# Altium project Project_ontwerpen_Soldeer_bout.PrjPcb
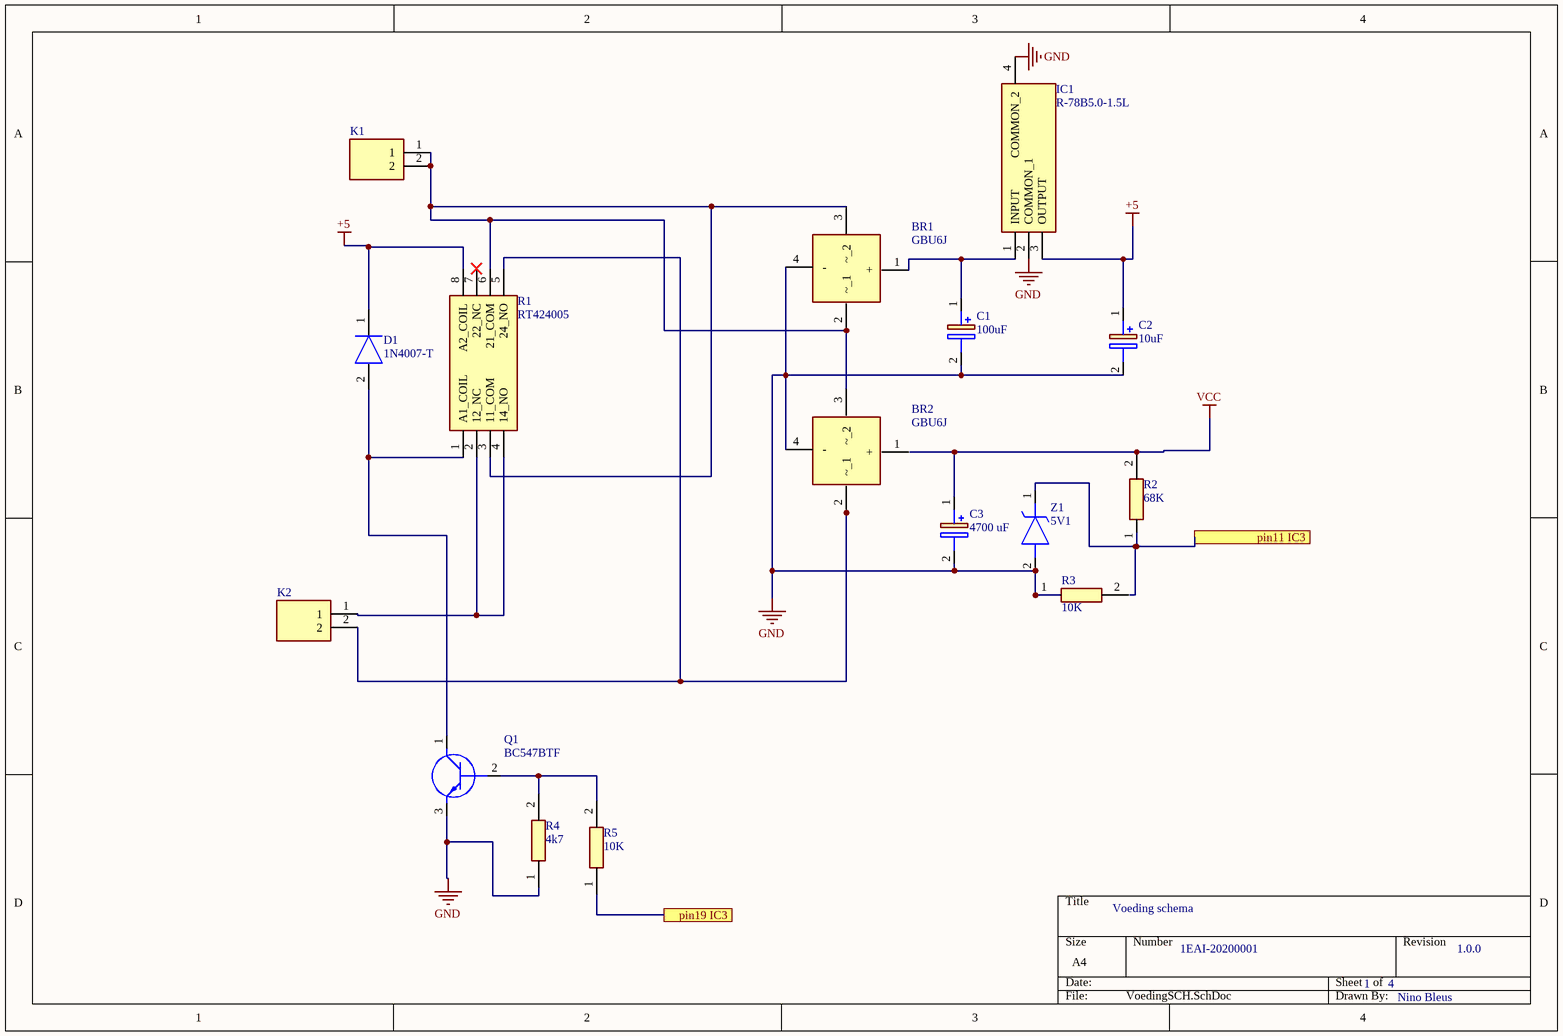
[diagram p0: VoedingSCH.SchDoc]
4 sheets, 72 parts. Net scope: flat (ports and power ports of the same name join across sheets).
Board file: PCB1.PcbDoc
Sheets:
  VoedingSCH.SchDoc
  Soldeerboute.SchDoc
  Display.SchDoc
  MainBoard.SchDoc

## Sheet VoedingSCH.SchDoc: Voeding schema
size A4; DrawnBy: Nino Bleus; Engineer: Nino Bleus; Revision: 1.0.0; SheetNumber: 1; SheetTotal: 4; number: 1EAI-20200001

### Parts
BR1  GBU6J  [GBU6J]
BR2  GBU6J  [GBU6J]
C1  100uF  [CAPPRD350W60D800H1250]
C2  10uF  [CAPPRD250W45D630H850]
C3  4700 uF  [CAPPRD1000W80D2200H3700]
D1  1N4007-T  [DIOAD1408W86L464D236]
IC1  R-78B5.0-1.5L  [TL78005CKTTR]
K1  printkroonconnector  [1729128]  (value not drawn)
K2  printkroonconnector  [1729128]  (value not drawn)
Q1  BC547BTF  [BC33740TA]
R1  RT424005  [RT42]
R2  68K  [RESC2012X65N]
R3  10K  [RESC2012X65N]
R4  4k7  [RESC2012X65N]
R5  10K  [RESC2012X65N]
Z1  5V1  [DIOAD1068W53L380D172]

### Ports
pin11 IC3, pin19 IC3

### Nets
+5: C2.1(+) D1.1(K) IC1.3(OUTPUT) R1.8(A2_COIL)
GND: BR1.4(-) BR2.4(-) C1.2(-) C2.2(-) C3.2(-) IC1.2(COMMON_1) IC1.4(COMMON_2) Q1.3(E) R3.1 R4.1 Z1.2(A)
VCC: C3.1(+) R2.2
NetBR1_1: BR1.1(+) C1.1(+) IC1.1(INPUT)
NetBR1_2: BR1.2(~_1) BR1.3(~_2) BR2.3(~_2) K1.1 K1.2 R1.3(11_COM) R1.6(21_COM)
NetBR2_2: BR2.2(~_1) K2.2 R1.5(24_NO)
NetD1_2: D1.2(A) Q1.1(C) R1.1(A1_COIL)
NetIC3_11: R2.1 Z1.1(K) ; port pin11 IC3
NetIC3_19: R5.1 ; port pin19 IC3
NetK2_1: K2.1 R1.2(12_NC) R1.4(14_NO)
NetQ1_2: Q1.2(B) R4.2 R5.2

Not connected (* = marked no-connect by the designer): BR2 1(+); R1 7(22_NC)*; R3 2

### Library data of the parts
BR1 BR2 = GBU6J: Bridge Rectifier; Manufacturer_Name: GeneSiC Semiconductor; Datasheet Link: https://www.diodemodule.com/silicon_products/bridge_rectifiers/gbu6j.pdf; Height: 18.8mm; Manufacturer_Part_Number: GBU6J
C1 = ESK107M050AG3EA: Capacitor Polarised; Manufacturer_Name: Kemet; Height: 12.5mm; Manufacturer_Part_Number: ESK107M050AG3EA
C2 = 10uF Capaciteit: Capacitor Polarised; Manufacturer_Name: Kemet; Manufacturer_Part_Number: ESS106M050AE2AA; Datasheet Link: https://content.kemet.com/datasheets/KEM_A4057_ESS.pdf; Height: 8.5mm
C3 = 4700 uF capaciteit: Capacitor Polarised; Manufacturer_Name: Kemet; Manufacturer_Part_Number: ESK478M050AQ3AA; Datasheet Link: https://componentsearchengine.com//ESK478M050AQ3AA.pdf; Height: 37mm; Mouser2 Part Number: 80-ESK478M050AQ3AA; Mouser2 Price/Stock: https://www.mouser.com/Search/Refine.aspx?Keyword=80-ESK478M050AQ3AA
D1 = 1N4007-T: Diode; Manufacturer_Name: Rectron; Datasheet Link: https://componentsearchengine.com//1N4007-T.pdf; Mouser2 Part Number: 583-1N4007-T; Mouser2 Price/Stock: https://www.mouser.com/Search/Refine.aspx?Keyword=583-1N4007-T; Manufacturer_Part_Number: 1N4007-T
IC1 = TL780-05CKTTR: Integrated Circuit; Manufacturer_Name: Texas Instruments; Datasheet Link: http://www.ti.com/general/docs/suppproductinfo.tsp?distId=26&gotoUrl=http%3A%2F%2Fwww.ti.com%2Flit%2Fgpn%2Ftl780; Height: 5.08mm; Manufacturer_Part_Number: TL780-05CKTTR
K1 K2 = printkroonconnector: Connector; Manufacturer_Name: Phoenix Contact; Datasheet Link: http://www.phoenixcontact.com/de/produkte/1729128/pdf; Height: 10.15mm; Manufacturer_Part_Number: 1729128
Q1 = BC547BTF: Transistor BJT NPN; Manufacturer_Name: ON Semiconductor; Datasheet Link: https://www.onsemi.com/pub/Collateral/BC550-D.pdf; Manufacturer_Part_Number: BC547BTF
R1 = RT424005: Relay or Contactor; Manufacturer_Name: TE Connectivity; Datasheet Link: https://componentsearchengine.com//RT424005.pdf; Mouser2 Part Number: 655-RT424005; Mouser2 Price/Stock: https://www.mouser.com/Search/Refine.aspx?Keyword=655-RT424005; Manufacturer_Part_Number: RT424005
R2-R5 = ESR10EZPJ183: Resistor; Manufacturer_Name: ROHM Semiconductor; Datasheet Link: https://datasheet.datasheetarchive.com/originals/distributors/Datasheets_SAMA/30ccb516c688c96e56c83a00b77a93f4.pdf; Height: 0.65mm; Manufacturer_Part_Number: ESR10EZPJ183
Z1 = 1N5231B: Zener Diode; Manufacturer_Name: ON Semiconductor; Manufacturer_Part_Number: 1N5231B

## Sheet Soldeerboute.SchDoc: Project ontwerpen soldeerbout
size A4; DrawnBy: Nino Bleus; Engineer: Nino Bleus; Revision: 1.0.0; SheetNumber: 2; SheetTotal: 4; Number: PXLEAI_20220001
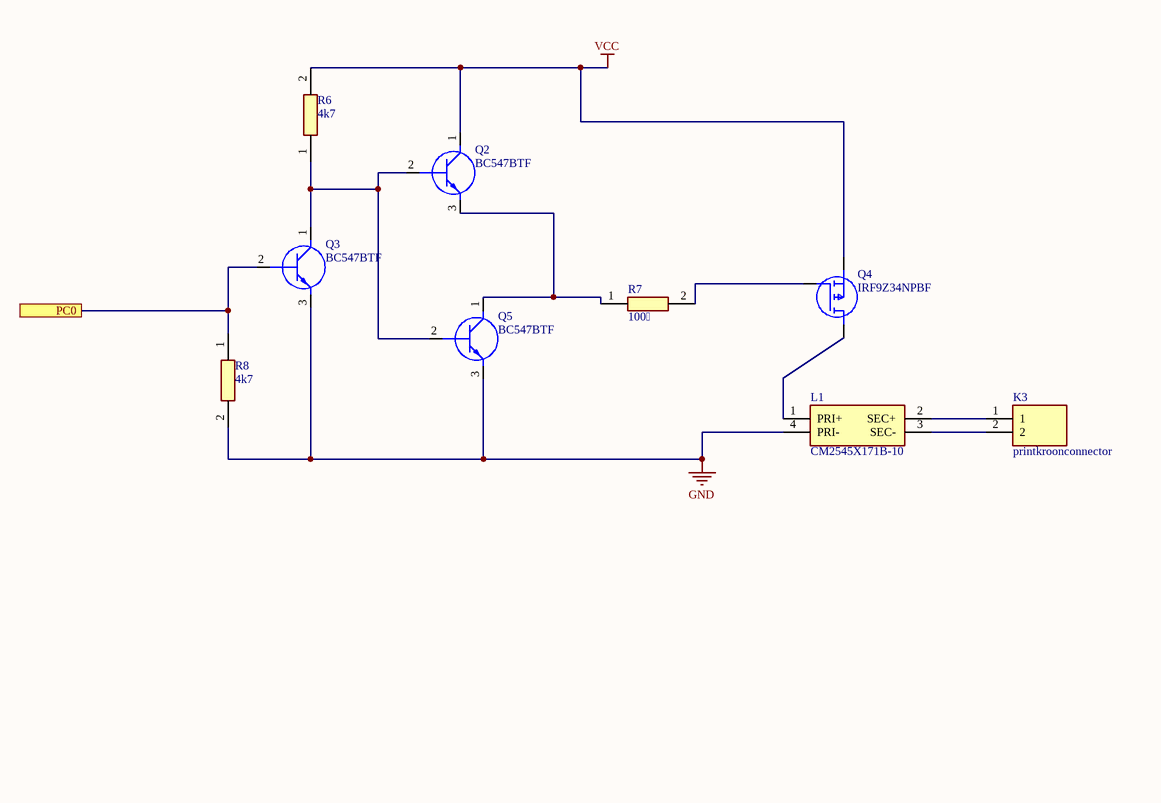
[diagram p1: Soldeerboute.SchDoc]

### Parts
K3  printkroonconnector  [1729128]
L1  CM2545X171B-10  [CM2545X171B10]
Q2  BC547BTF  [BC33740TA]
Q3  BC547BTF  [BC33740TA]
Q4  IRF9Z34NPBF  [TO254P469X1042X1967-3P]
Q5  BC547BTF  [BC33740TA]
R6  4k7  [RESC2012X65N]
R7  100  [RESC2012X65N]
R8  4k7  [RESC2012X65N]

### Ports
PC0

### Nets
GND: L1.4(PRI-) Q3.3(E) Q5.3(E) R8.2
VCC: Q2.1(C) Q4.2(S) R6.2
NetIC3_1: Q3.2(B) R8.1 ; port PC0
NetK3_1: K3.1 L1.2(SEC+)
NetK3_2: K3.2 L1.3(SEC-)
NetL1_1: L1.1(PRI+) Q4.3(D)
NetQ2_2: Q2.2(B) Q3.1(C) Q5.2(B) R6.1
NetQ2_3: Q2.3(E) Q5.1(C) R7.1
NetQ4_1: Q4.1(G) R7.2

### Library data of the parts
K3 = printkroonconnector: as K1 on sheet VoedingSCH; Datasheet Link: http://www.phoenixcontact.com/de/produkte/1729128/pdf; Height: 10.15mm; Manufacturer_Part_Number: 1729128
L1 = CM2545X171B-10: Transformer; Manufacturer_Name: Laird Technologies; Datasheet Link: https://datasheet.datasheetarchive.com/originals/dk/DKDS-7/122753.pdf; Height: 9.5mm; Manufacturer_Part_Number: CM2545X171B-10
Q2 Q3 Q5 = BC547BTF: as Q1 on sheet VoedingSCH; Datasheet Link: https://www.onsemi.com/pub/Collateral/BC550-D.pdf; Manufacturer_Part_Number: BC547BTF
Q4 = IRF9Z34NPBF: MOSFET (P-Channel); Manufacturer_Name: Infineon; Datasheet Link: https://componentsearchengine.com//IRF9Z34NPBF.pdf; Height: 4.69mm; Mouser2 Part Number: 942-IRF9Z34NPBF; Mouser2 Price/Stock: https://www.mouser.com/Search/Refine.aspx?Keyword=942-IRF9Z34NPBF; Manufacturer_Part_Number: IRF9Z34NPBF
R6-R8 = ESR10EZPJ183: as R2 on sheet VoedingSCH; Datasheet Link: https://datasheet.datasheetarchive.com/originals/distributors/Datasheets_SAMA/30ccb516c688c96e56c83a00b77a93f4.pdf; Height: 0.65mm; Manufacturer_Part_Number: ESR10EZPJ183

## Sheet Display.SchDoc: display
size A4; DrawnBy: Nino Bleus; DocumentNumber: PXLEAI_2022_0001; Revision: 1.0.0; SheetNumber: 3; SheetTotal: 4
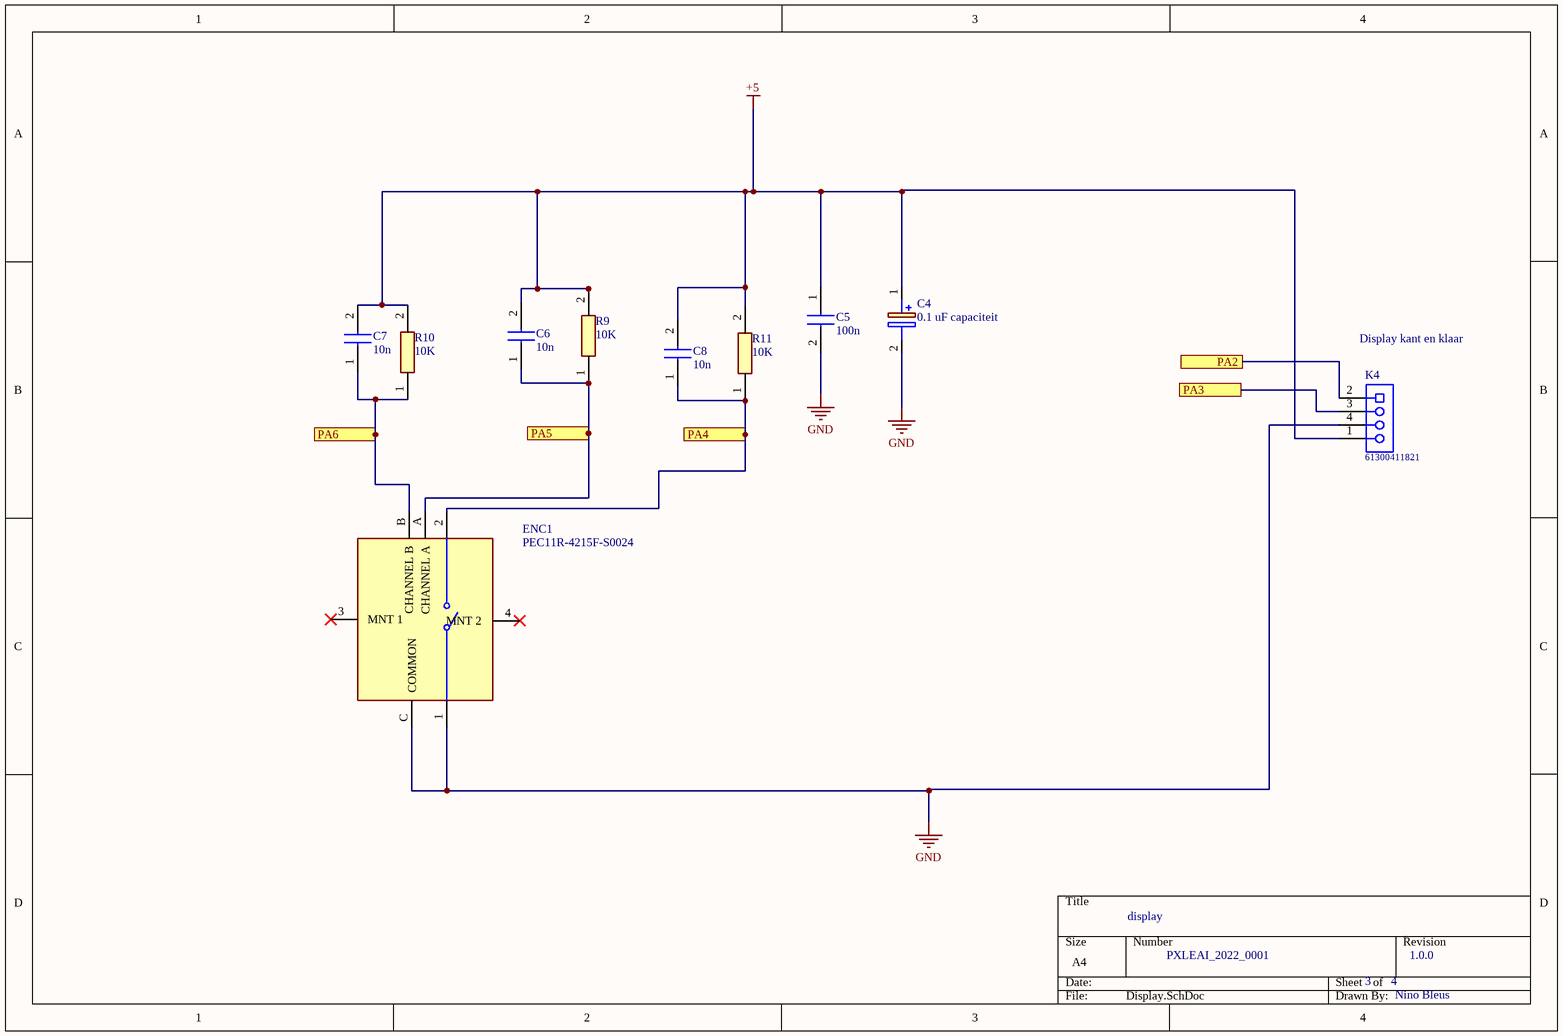
[diagram p2: Display.SchDoc]

### Parts
C4  0.1 uF capaciteit  [CAPPRD200W52D500H1250]
C5  100n  [CAPC2012X88N]
C6  10n  [CAPC2012X88N]
C7  10n  [CAPC2012X88N]
C8  10n  [CAPC2012X88N]
ENC1  PEC11R-4215F-S0024  [FP-PEC11R-4215F-S0024-MFG]
K4  61300411821  [61300411821]
R9  10K  [RESC2012X65N]
R10  10K  [RESC2012X65N]
R11  10K  [RESC2012X65N]

### Ports
PA2, PA3, PA4, PA5, PA6

### Nets
+5: C4.1(+) C5.1 C6.2 C7.2 C8.2 K4.1 R9.2 R10.2 R11.2
GND: C4.2(-) C5.2 ENC1.1 ENC1.C(COMMON) K4.4
NetC6_1: C6.1 ENC1.A(CHANNEL_A) R9.1 ; port PA5
NetC7_1: C7.1 ENC1.B(CHANNEL_B) R10.1 ; port PA6
NetC8_1: C8.1 ENC1.2 R11.1 ; port PA4
NetIC3_35: K4.2 ; port PA2
NetIC3_36: K4.3 ; port PA3

Not connected (* = marked no-connect by the designer): ENC1 3(MNT_1)* 4(MNT_2)*

### Notes on the sheet
- (near K4) Display kant en klaar

### Library data of the parts
C4 = 0.1 uF capaciteit: Capacitor Polarised; Manufacturer_Name: Wurth Elektronik; Manufacturer_Part_Number: 860010672001; Datasheet Link: http://katalog.we-online.com/pbs/datasheet/860010672001.pdf; Height: 12.5mm
C5-C8 = C0805C103K5RACTU: Capacitor; Manufacturer_Name: Kemet; Datasheet Link: https://ms.componentsearchengine.com/Datasheets/2/C0805C103K5RACTU.pdf; Height: 0.88mm; Manufacturer_Part_Number: C0805C103K5RACTU
ENC1 = CMP-1747-00012-2: ROTARY ENCODER MECHANICAL 24PPR; Hole Diameter: 1.8mm; Output Type: Quadrature; Pulses per Revolution: 24; Number of Channels: 2; Built in Switch: Yes; Min Operating Temperature: -30°C; Series: PEC11R; Type: Mechanical; Package Quantity: 150; Length: 21.5mm; Max Operating Temperature: 70°C; Encoder Type: Mechanical; Height: 13.4mm; Detent: Yes; Packaging: Bulk; Orientation: Vertical; Width: 12.5mm; Termination: PC Pins; Mount: Through Hole; REACH SVHC: No SVHC; Radiation Hardening: No; RoHS Compliant: Yes
K4 = 61300411821: WR-PHD Socket Header, THT, pitch 2.54mm, Single Row, Vertical, 4p; Manufacturer: Wurth Elektronik; Pin Number: 4; Rated Current: 3A; Working Voltage: 250VAC; Withstanding Voltage: 500VAC; Contact Resistance: 20mOhm; ComponentLink1Description: Manufacturer; ComponentLink1URL: http://www.we-online.de; ComponentLink2Description: Datasheet; ComponentLink2URL: https://www.we-online.com/catalog/datasheet/61300411821.pdf; Manufacturer Part Number: 61300411821; Pitch: 2.54mm; Operating Temperature: -40 to +125degC; Mounting Technology: THT; Packaging: Tray; Gender: Socket Header; Row Number: Single; Orientation: Vertical
R9-R11 = ESR10EZPJ183: as R2 on sheet VoedingSCH; Datasheet Link: https://datasheet.datasheetarchive.com/originals/distributors/Datasheets_SAMA/30ccb516c688c96e56c83a00b77a93f4.pdf; Height: 0.65mm; Manufacturer_Part_Number: ESR10EZPJ183

## Sheet MainBoard.SchDoc: Main IC
size A4; DrawnBy: Nino Bleus; DocumentNumber: 1EAI2020001; Revision: V1.0.0; SheetNumber: 4; SheetTotal: 4; Application_BuildNumber: 1EAI2020001
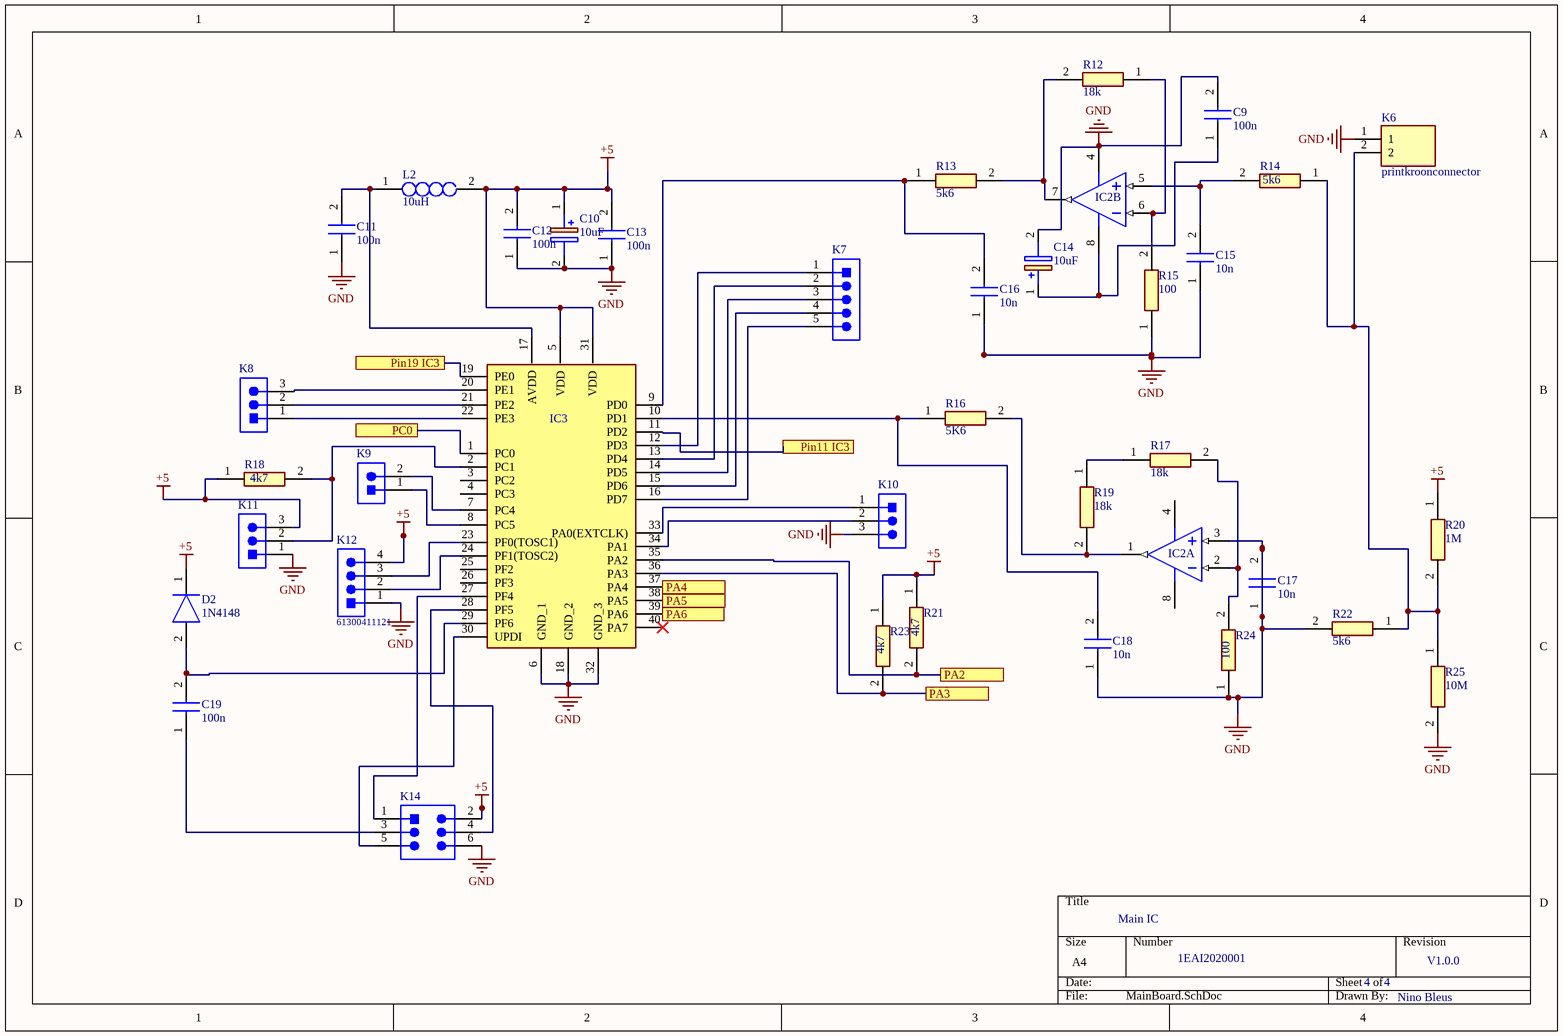
[diagram p3: MainBoard.SchDoc]

### Parts
C9  100n  [CAPC2012X88N]
C10  10uF  [CAPPRD250W45D630H850]
C11  100n  [CAPC2012X88N]
C12  100n  [CAPC2012X88N]
C13  100n  [CAPC2012X88N]
C14  10uF  [CAPPRD250W45D630H850]
C15  10n  [CAPC2012X88N]
C16  10n  [CAPC2012X88N]
C17  10n  [CAPC2012X88N]
C18  10n  [CAPC2012X88N]
C19  100n  [CAPC2012X88N]
D2  1N4148  [DIOAD1165W56L425D185]
IC2  MCP6002-E/P  [PDIP300-P8]  (value not drawn)  (parts A,B of 2)
IC3  ATMEGA4809-PF  [DIP1543W58P254L5175H635Q40N]  (value not drawn)
K6  printkroonconnector  [1729128]
K7  61300511121  [61300511121]  (value not drawn)
K8  61300311121  [61300311121]  (value not drawn)
K9  61300211121  [61300211121]  (value not drawn)
K10  61300311121  [61300311121]  (value not drawn)
K11  61300311121  [61300311121]  (value not drawn)
K12  61300411121  [61300411121]
K14  61300621121  [61300621121]  (value not drawn)
L2  10uH  [INDAD1827W51L711D279]
R12  18k  [RESC2012X65N]
R13  5k6  [RESC2012X65N]
R14  5k6  [RESC2012X65N]
R15  100  [RESC2012X65N]
R16  5K6  [RESC2012X65N]
R17  18k  [RESC2012X65N]
R18  4k7  [RESC2012X65N]
R19  18k  [RESC2012X65N]
R20  1M  [RESC2012X65N]
R21  4k7  [RESC2012X65N]
R22  5k6  [RESC2012X65N]
R23  4k7  [RESC2012X65N]
R24  100  [RESC2012X65N]
R25  10M  [RESC2012X65N]

### Ports
PA2, PA3, PA4, PA5, PA6, PC0, Pin11 IC3, Pin19 IC3

### Nets
+5: C10.1(+) C12.2 C13.2 D2.1(K) IC3.5(VDD) IC3.31(VDD) K11.3 K12.4 K14.2 L2.2 R18.1 R20.1 R21.1 R23.1
GND: C9.2 C10.2(-) C11.1 C12.1 C13.1 C14.2(-) C15.1 C16.1 C17.1 C17.2 C18.1 IC2.3(VINA+) IC2.4(VSS) IC3.6(GND_1) IC3.18(GND_2) IC3.32(GND_3) K6.1 K10.3 K11.1 K12.1 K14.6 R15.1 R22.2 R24.1 R25.2
NetC6_1: IC3.38(PA5) ; port PA5
NetC7_1: IC3.39(PA6) ; port PA6
NetC8_1: IC3.37(PA4) ; port PA4
NetC9_1: C9.1 C14.1(+) IC2.8(VDD)
NetC11_2: C11.2 IC3.17(AVDD) L2.1
NetC15_2: C15.2 IC2.5(VINB+) R14.2
NetC16_2: C16.2 IC3.9(PD0) R13.1
NetC18_2: C18.2 IC3.10(PD1) R16.1
NetC19_1: C19.1 K14.3
NetC19_2: C19.2 D2.2(A) IC3.29(PF6)
NetIC2_1: IC2.1(VOUTA) R16.2 R19.2
NetIC2_2: IC2.2(VINA-) R17.2 R24.2
NetIC2_6: IC2.6(VINB-) R12.1 R15.2
NetIC2_7: IC2.7(VOUTB) R12.2 R13.2
NetIC3_1: IC3.1(PC0) ; port PC0
NetIC3_2: IC3.2(PC1) K11.2 R18.2
NetIC3_7: IC3.7(PC4) K9.2
NetIC3_8: IC3.8(PC5) K9.1
NetIC3_11: IC3.11(PD2) ; port Pin11 IC3
NetIC3_12: IC3.12(PD3) K7.1
NetIC3_13: IC3.13(PD4) K7.2
NetIC3_14: IC3.14(PD5) K7.3
NetIC3_15: IC3.15(PD6) K7.4
NetIC3_16: IC3.16(PD7) K7.5
NetIC3_19: IC3.19(PE0) ; port Pin19 IC3
NetIC3_20: IC3.20(PE1) K8.3
NetIC3_21: IC3.21(PE2) K8.2
NetIC3_22: IC3.22(PE3) K8.1
NetIC3_23: IC3.23(PF0(TOSC1)) K12.3
NetIC3_24: IC3.24(PF1(TOSC2)) K12.2
NetIC3_27: IC3.27(PF4) K14.1
NetIC3_28: IC3.28(PF5) K14.4
NetIC3_30: IC3.30(UPDI) K14.5
NetIC3_33: IC3.33(PA0(EXTCLK)) K10.1
NetIC3_34: IC3.34(PA1) K10.2
NetIC3_35: IC3.35(PA2) R21.2 ; port PA2
NetIC3_36: IC3.36(PA3) R23.2 ; port PA3
NetK6_2: K6.2 R14.1 R20.2 R22.1 R25.1
NetR17_1: R17.1 R19.1

Not connected (* = marked no-connect by the designer): IC3 3(PC2) 4(PC3) 25(PF2) 26(PF3) 40(PA7)*

### Library data of the parts
C9 C11-C13 C15-C19 = 0805 SMD capaciteit: Capacitor; Manufacturer_Name: Kemet; Manufacturer_Part_Number: C0805C103K5RACTU; Datasheet Link: https://ms.componentsearchengine.com/Datasheets/2/C0805C103K5RACTU.pdf; Height: 0.88mm
C10 C14 = 10uF Capaciteit: as C2 on sheet VoedingSCH; Datasheet Link: https://content.kemet.com/datasheets/KEM_A4057_ESS.pdf; Height: 8.5mm
D2 = 1N4148: Diode; Manufacturer_Name: Nexperia; Datasheet Link: https://datasheet.datasheetarchive.com/originals/distributors/Datasheets-112/DSAP0040891.pdf; Manufacturer_Part_Number: 1N4148
IC2 = CMP-0187-00133-3: None; Slew Rate: 0.6V/µs; Supply Current: 100uA; Power Supply Rejection Ratio (PSRR): 86dB; Input Offset Voltage (Vos): 4.5mV; Input Bias Current: 1pA; Amplifier Type: GENERAL PURPOSE; Unity Gain Bandwidth Product: 1MHz; Number of Circuits: 2; Output Current: 23mA; Operating Supply Voltage: 5.5V; Min Supply Voltage: 1.8V; Common Mode Rejection Ratio: 60dB; Voltage Gain: 112dB; Max Supply Voltage: 6V; Package Quantity: 60; REACH SVHC: No SVHC; Min Operating Temperature: -40°C; Max Operating Temperature: 125°C; Mount: Through Hole; Nominal Supply Current: 100uA; Height: 3.3mm; Length: 9.27mm; Slew Rate-Nom: 0.6V/µs; Packaging: Rail/Tube; Output Current per Channel: 23mA; Number of Amplifiers: 2; RoHS Compliant: Yes; Radiation Hardening: No; Bandwidth: 1MHz; Lead Free: Lead Free; Width: 6.35mm; Number of Channels: 2; Gain Bandwidth Product: 1MHz; Technology: CMOS; Operating Supply Current: 100uA; Number of Elements: 2; Number of Pins: 8; Input Offset Voltage-Max: 4.5mV; Case/Package: PDIP
IC3 = ATMEGA4809-PF: Integrated Circuit; Manufacturer_Name: Microchip; Datasheet Link: https://componentsearchengine.com//ATMEGA4809-PF.pdf; Height: 6.35mm; Mouser2 Part Number: 556-ATMEGA4809-PF; Mouser2 Price/Stock: https://www.mouser.com/Search/Refine.aspx?Keyword=556-ATMEGA4809-PF; Manufacturer_Part_Number: ATMEGA4809-PF
K6 = printkroonconnector: as K1 on sheet VoedingSCH; Datasheet Link: http://www.phoenixcontact.com/de/produkte/1729128/pdf; Height: 10.15mm; Manufacturer_Part_Number: 1729128
K7 = 61300511121: WR-PHD Pin Header, THT, pitch 2.54mm, Single Row, Vertical, 5p; Manufacturer: Wurth Elektronik; Pin Number: 5; Rated Current: 3A; Working Voltage: 250VAC; Withstanding Voltage: 500VAC; Contact Resistance: 20mOhm; ComponentLink1Description: Manufacturer; ComponentLink1URL: http://www.we-online.de; ComponentLink2Description: Datasheet; ComponentLink2URL: https://www.we-online.com/catalog/datasheet/61300511121.pdf; Manufacturer Part Number: 61300511121; Pitch: 2.54mm; Operating Temperature: -40 to +105degC; Mounting Technology: THT; Packaging: Bag; Gender: Pin Header; Row Number: Single; Orientation: Vertical
K8 K10 K11 = 61300311121: WR-PHD Pin Header, THT, pitch 2.54mm, Single Row, Vertical, 3p; Manufacturer: Wurth Elektronik; Pin Number: 3; Rated Current: 3A; Working Voltage: 250VAC; Withstanding Voltage: 500VAC; Contact Resistance: 20mOhm; ComponentLink1Description: Manufacturer; ComponentLink1URL: http://www.we-online.de; ComponentLink2Description: Datasheet; ComponentLink2URL: https://www.we-online.com/catalog/datasheet/61300311121.pdf; Manufacturer Part Number: 61300311121; Pitch: 2.54mm; Operating Temperature: -40 to +105degC; Mounting Technology: THT; Packaging: Bag; Gender: Pin Header; Row Number: Single; Orientation: Vertical
K9 = 61300211121: WR-PHD Pin Header, THT, pitch 2.54mm, Single Row, Vertical, 2p; Manufacturer: Wurth Elektronik; Pin Number: 2; Rated Current: 3A; Working Voltage: 250VAC; Withstanding Voltage: 500VAC; Contact Resistance: 20mOhm; ComponentLink1Description: Manufacturer; ComponentLink1URL: http://www.we-online.de; ComponentLink2Description: Datasheet; ComponentLink2URL: https://www.we-online.com/catalog/datasheet/61300211121.pdf; Manufacturer Part Number: 61300211121; Pitch: 2.54mm; Operating Temperature: -40 to +105degC; Mounting Technology: THT; Packaging: Bag; Gender: Pin Header; Row Number: Single; Orientation: Vertical
K12 = 61300411121: WR-PHD Pin Header, THT, pitch 2.54mm, Single Row, Vertical, 4p; Manufacturer: Wurth Elektronik; Pin Number: 4; Rated Current: 3A; Working Voltage: 250VAC; Withstanding Voltage: 500VAC; Contact Resistance: 20mOhm; ComponentLink1Description: Manufacturer; ComponentLink1URL: http://www.we-online.de; ComponentLink2Description: Datasheet; ComponentLink2URL: https://www.we-online.com/catalog/datasheet/61300411121.pdf; Manufacturer Part Number: 61300411121; Pitch: 2.54mm; Operating Temperature: -40 to +105degC; Mounting Technology: THT; Packaging: Bag; Gender: Pin Header; Row Number: Single; Orientation: Vertical
K14 = 61300621121: WR-PHD Pin Header, THT, pitch 2.54mm, Dual Row, Vertical, 6p; Manufacturer: Wurth Elektronik; Pin Number: 6; Rated Current: 3A; Working Voltage: 250VAC; Withstanding Voltage: 500VAC; Contact Resistance: 20mOhm; ComponentLink1Description: Manufacturer; ComponentLink1URL: http://www.we-online.de; ComponentLink2Description: Datasheet; ComponentLink2URL: https://www.we-online.com/catalog/datasheet/61300621121.pdf; Manufacturer Part Number: 61300621121; Pitch: 2.54mm; Operating Temperature: -40 to +105degC; Mounting Technology: THT; Packaging: Bag; Gender: Pin Header; Row Number: Dual; Orientation: Vertical
L2 = 78F100J-RC: Inductor; Manufacturer_Name: Bourns; Datasheet Link: https://componentsearchengine.com//78F100J-RC.pdf; Mouser2 Part Number: 542-78F100-RC; Mouser2 Price/Stock: https://www.mouser.com/Search/Refine.aspx?Keyword=542-78F100-RC; Manufacturer_Part_Number: 78F100J-RC
R12-R25 = ESR10EZPJ183: as R2 on sheet VoedingSCH; Datasheet Link: https://datasheet.datasheetarchive.com/originals/distributors/Datasheets_SAMA/30ccb516c688c96e56c83a00b77a93f4.pdf; Height: 0.65mm; Manufacturer_Part_Number: ESR10EZPJ183

## Nets that join several sheets
+5: VoedingSCH (C2.1 D1.1 IC1.3 R1.8), Display (9 pins), MainBoard (14 pins)
GND: VoedingSCH (11 pins), Soldeerboute (L1.4 Q3.3 Q5.3 R8.2), Display (5 pins), MainBoard (25 pins)
VCC: VoedingSCH (C3.1 R2.2), Soldeerboute (Q2.1 Q4.2 R6.2)
NetC6_1: Display (C6.1 ENC1.A R9.1), MainBoard (IC3.38)
NetC7_1: Display (C7.1 ENC1.B R10.1), MainBoard (IC3.39)
NetC8_1: Display (C8.1 ENC1.2 R11.1), MainBoard (IC3.37)
NetIC3_1: Soldeerboute (Q3.2 R8.1), MainBoard (IC3.1)
NetIC3_11: VoedingSCH (R2.1 Z1.1), MainBoard (IC3.11)
NetIC3_19: VoedingSCH (R5.1), MainBoard (IC3.19)
NetIC3_35: Display (K4.2), MainBoard (IC3.35 R21.2)
NetIC3_36: Display (K4.3), MainBoard (IC3.36 R23.2)